# Altium schematic sheet MAGI'sWiFi.SchDoc
size A4
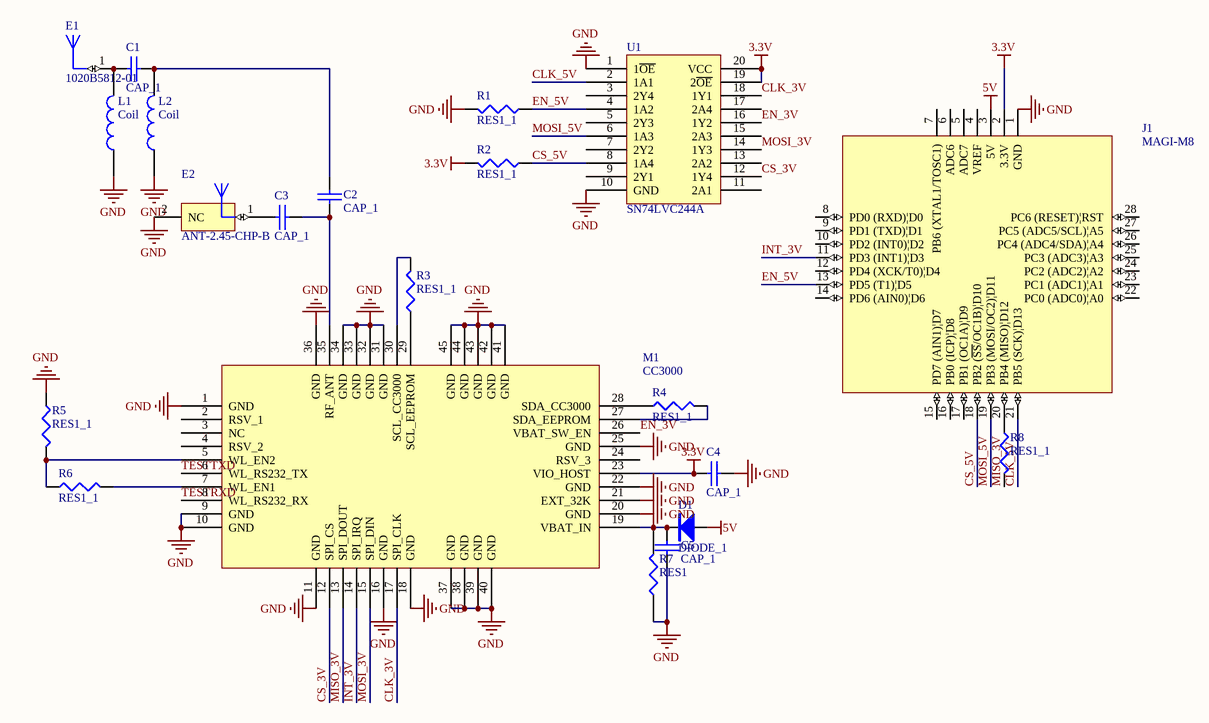
[diagram p0: MAGI'sWiFi.SchDoc]

## Parts
C1  CAP_1  [1608[0603]]
C2  CAP_1  [1608[0603]]
C3  CAP_1  [1608[0603]]
C4  CAP_1  [6-0805_N]
C5  CAP_1  [6-0805_N]
D1  DIODE_1  [SMA]
E1  1020B5812-01  [AT8010-E2R9HAA]
E2  ANT-2.45-CHP-B  [U.FL]
J1  MAGI-M8  [MAGI-M8]
L1  Coil  [1608[0603]]
L2  Coil  [1608[0603]]
M1  CC3000  [CC3000MOD]
R1  RES1_1  [6-0805_N]
R2  RES1_1  [6-0805_N]
R3  RES1_1  [1608[0603]]
R4  RES1_1  [1608[0603]]
R5  RES1_1  [1608[0603]]
R6  RES1_1  [1608[0603]]
R7  RES1  [6-0805_N]
R8  RES1_1  [1608[0603]]
U1  SN74LVC244A  [SN74LVC244APWRG]

## Nets
3.3V: C4.1 J1.2(3.3V) M1.23(VIO_HOST) R2.2 U1.19(2~{OE}) U1.20(VCC)
5V: D1.1(A) J1.3(5V)
GND: C4.2 C5.2 E2.2(NC) J1.1(GND) L1.1 L2.1 M1.1(GND) M1.9(GND) M1.10(GND) M1.11(GND) M1.16(GND) M1.18(GND) M1.20(GND) M1.21(EXT_32K) M1.22(GND) M1.25(GND) M1.31(GND) M1.32(GND) M1.33(GND) M1.34(GND) M1.36(GND) M1.37(GND) M1.38(GND) M1.39(GND) M1.40(GND) M1.41(GND) M1.42(GND) M1.43(GND) M1.44(GND) M1.45(GND) R1.2 R5.1 R7.1 U1.1(1~{OE}) U1.10(GND)
CLK_3V: M1.17(SPI_CLK) U1.18(1Y1)
CLK_5V: J1.21(PB5_(SCK)|D13) U1.2(1A1)
CS_3V: M1.12(SPI_CS) U1.12(1Y4)
CS_5V: J1.18(PB2_(~{SS}/OC1B)|D10) R2.1 U1.8(1A4)
EN_3V: M1.26(VBAT_SW_EN) U1.16(1Y2)
EN_5V: J1.13(PD5_(T1)|D5) R1.1 U1.4(1A2)
INT_3V: J1.11(PD3_(INT1)|D3) M1.14(SPI_IRQ)
MISO_3V: M1.13(SPI_DOUT) R8.2
MOSI_3V: M1.15(SPI_DIN) U1.14(1Y3)
MOSI_5V: J1.19(PB3_(MOSI/OC2)|D11) U1.6(1A3)
TESTRXD: M1.8(WL_RS232_RX)
TESTTXD: M1.6(WL_RS232_TX)
NetC1_1: C1.1 C2.2 L2.2
NetC1_2: C1.2 E1.1(FEED) L1.2
NetC2_1: C2.1 C3.1 M1.35(RF_ANT)
NetC3_2: C3.2 E2.1(FEED)
NetC5_1: C5.1 D1.2(K) M1.19(VBAT_IN) R7.2
NetJ1_20: J1.20(PB4_(MISO)|D12) R8.1
NetM1_5: M1.5(WL_EN2) R5.2 R6.1
NetM1_7: M1.7(WL_EN1) R6.2
NetM1_27: M1.27(SDA_EEPROM) R4.2
NetM1_28: M1.28(SDA_CC3000) R4.1
NetM1_29: M1.29(SCL_EEPROM) R3.1
NetM1_30: M1.30(SCL_CC3000) R3.2

Not connected (* = marked no-connect by the designer): J1 4(VREF) 5(ADC7) 6(ADC6) 7(PB6_(XTAL1/TOSC1)) 8(PD0_(RXD)|D0) 9(PD1_(TXD)|D1) 10(PD2_(INT0)|D2) 12(PD4_(XCK/T0)|D4) 14(PD6_(AIN0)|D6) 15(PD7_(AIN1)|D7) 16(PB0_(ICP)|D8) 17(PB1_(OC1A)|D9) 22(PC0_(ADC0)|A0) 23(PC1_(ADC1)|A1) 24(PC2_(ADC2)|A2) 25(PC3_(ADC3)|A3) 26(PC4_(ADC4/SDA)|A4) 27(PC5_(ADC5/SCL)|A5) 28(PC6_(RESET)|RST); M1 2(RSV_1) 3(NC) 4(RSV_2) 24(RSV_3); U1 3(2Y4) 5(2Y3) 7(2Y2) 9(2Y1) 11(2A1) 13(2A2) 15(2A3) 17(2A4)

## Library data of the parts
C1-C5 = CAP_1: Capacitor
D1 = DIODE_1: Diode
E1 = 1020B5812-01: Flavus GSM Snap-In Antenna, 800/900/1800/1900 MHz, 0.8mm PCB Thickness; PCB_Layout: Complies with manufacturer's recommendation.; Published: 30-May-2008; DatasheetVersion: AE030090-C; PackageVersion: Feb-2007; PackageReference: ANT27.3X7.9; Publisher: Altium Limited; PackageDescription: Snap-In Antenna, Plastic; Body 27.3 x 7.9 mm (LxW); ComponentLink1Description: Manufacturer Link; ComponentLink1URL: http://www.antenova.com/; ComponentLink2Description: Datasheet; ComponentLink2URL: http://www.antenova.com/?id=855&pv=1&lang=1
E2 = ANT-2.45-CHP-B: 2.45GHz Ultra-Compact, LTCC, Chip Antenna, Bulk; PCB_Layout: Complies with manufacturer's recommendation.; Published: 14-Mar-2008; DatasheetVersion: Apr-2006; PackageVersion: Apr-2006; PackageReference: ANT-2.45-CHP; Publisher: Altium Limited; PackageDescription: Chip Antenna, LTCC; 2 Leads, Body 6.5 x 2.2 mm (LxW); ComponentLink1Description: Manufacturer Link; ComponentLink1URL: http://www.antennafactor.com/; ComponentLink2Description: Datasheet; ComponentLink2URL: http://www.antennafactor.com/documents/ANT-xxx-CHP-x_Data_Guide.pdf
U1 = 74LVC244